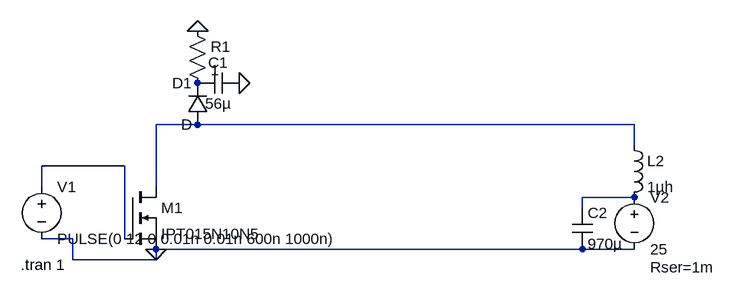
[diagram p0: schematic Asynchronous_boost_proto_1.asc]
Asynchronous_boost_proto_1.asc, the LTspice schematic file:
Version 4
SHEET 1 1060 680
WIRE 240 -16 176 -16
WIRE 912 -16 240 -16
WIRE 912 16 912 -16
WIRE 128 48 0 48
WIRE 0 80 0 48
WIRE 176 80 176 -16
WIRE 912 96 832 96
WIRE 832 112 832 96
WIRE 48 160 0 160
WIRE 128 160 128 48
WIRE 176 176 176 160
WIRE 832 176 176 176
WIRE 912 176 832 176
WIRE 48 192 48 160
WIRE 176 192 176 176
WIRE 176 192 48 192
FLAG 176 176 0
FLAG 304 -80 0
FLAG 240 -160 0
SYMBOL voltage 0 64 R0
WINDOW 123 0 0 Left 0
WINDOW 39 0 0 Left 0
SYMATTR InstName V1
SYMATTR Value PULSE(0 12 0 0.01n 0.01n 600n 1000n)
SYMBOL voltage 912 80 R0
WINDOW 123 0 0 Left 0
WINDOW 39 24 124 Left 2
SYMATTR SpiceLine Rser=1m
SYMATTR InstName V2
SYMATTR Value 25
SYMBOL ind 896 0 R0
SYMATTR InstName L2
SYMATTR Value 1µh
SYMATTR SpiceLine Rser=1m
SYMBOL diode 256 -16 R180
WINDOW 0 24 64 Left 2
WINDOW 3 24 0 Left 2
SYMATTR InstName D1
SYMBOL cap 304 -96 R90
WINDOW 0 0 32 VBottom 2
WINDOW 3 32 32 VTop 2
SYMATTR InstName C1
SYMATTR Value 56µ
SYMATTR SpiceLine Rser=1m
SYMBOL cap 816 112 R0
SYMATTR InstName C2
SYMATTR Value 970µ
SYMATTR SpiceLine Rser=1m
SYMBOL res 224 -176 R0
SYMATTR InstName R1
SYMATTR Value 1
SYMBOL nmos 128 80 R0
SYMATTR InstName M1
SYMATTR Value IPT015N10N5
TEXT -32 200 Left 2 !.tran 1

The netlist it stands for:
* Asynchronous_boost_proto_1.asc
V1 N002 0 PULSE(0 12 0 0.01n 0.01n 600n 1000n)
V2 N003 0 25 Rser=1m
L2 N001 N003 1µh Rser=1m
D1 N001 P001 D
C1 0 P001 56µ Rser=1m
C2 N003 0 970µ Rser=1m
R1 0 P001 1
M1 N001 N002 0 0 IPT015N10N5
.model D D
.lib standard.dio
.model NMOS NMOS
.model PMOS PMOS
.lib standard.mos
.tran 1
.backanno
.end